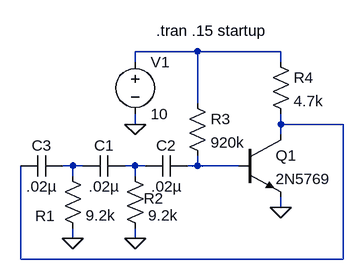
[diagram p0: schematic PhaseShiftOsc.asc]
PhaseShiftOsc.asc, the LTspice schematic file:
Version 4
SHEET 1 880 680
WIRE 192 0 96 0
WIRE 320 0 192 0
WIRE 96 16 96 0
WIRE 320 16 320 0
WIRE 192 80 192 0
WIRE 96 112 96 96
WIRE 320 112 320 96
WIRE 416 112 320 112
WIRE 320 128 320 112
WIRE 0 176 -16 176
WIRE 16 176 0 176
WIRE 96 176 80 176
WIRE 112 176 96 176
WIRE 192 176 192 160
WIRE 192 176 176 176
WIRE 256 176 192 176
WIRE 0 192 0 176
WIRE 96 192 96 176
WIRE 320 240 320 224
WIRE 0 288 0 272
WIRE 96 288 96 272
WIRE -80 320 -80 176
WIRE 416 320 416 112
WIRE 416 320 -80 320
FLAG 0 288 0
FLAG 96 288 0
FLAG 320 240 0
FLAG 96 112 0
SYMBOL res -16 176 R0
WINDOW 0 -42 77 Left 0
SYMATTR InstName R1
SYMATTR Value 9.2k
SYMBOL res 80 176 R0
WINDOW 0 29 50 Left 0
SYMATTR InstName R2
SYMATTR Value 9.2k
SYMBOL res 176 64 R0
SYMATTR InstName R3
SYMATTR Value 920k
SYMBOL res 304 0 R0
SYMATTR InstName R4
SYMATTR Value 4.7k
SYMBOL npn 256 128 R0
SYMATTR InstName Q1
SYMATTR Value 2N5769
SYMBOL cap 80 160 R90
WINDOW 0 0 32 VBottom 0
WINDOW 3 32 32 VTop 0
SYMATTR InstName C1
SYMATTR Value .02µ
SYMBOL cap 176 160 R90
WINDOW 0 0 32 VBottom 0
WINDOW 3 32 32 VTop 0
SYMATTR InstName C2
SYMATTR Value .02µ
SYMBOL cap -16 160 R90
WINDOW 0 0 32 VBottom 0
WINDOW 3 32 32 VTop 0
SYMATTR InstName C3
SYMATTR Value .02µ
SYMBOL voltage 96 0 R0
WINDOW 123 0 0 Left 0
WINDOW 39 0 0 Left 0
SYMATTR InstName V1
SYMATTR Value 10
TEXT 128 -32 Left 0 !.tran .15 startup

The netlist it stands for:
* PhaseShiftOsc.asc
R1 N003 0 9.2k
R2 N004 0 9.2k
R3 N001 N005 920k
R4 N001 N002 4.7k
Q1 N002 N005 0 0 2N5769
C1 N004 N003 .02µ
C2 N005 N004 .02µ
C3 N003 N002 .02µ
V1 N001 0 10
.model NPN NPN
.model PNP PNP
.lib standard.bjt
.tran .15 startup
.backanno
.end